# Altium schematic sheet Expansion.SchDoc: SION Expansion Board
size A4; Organization: UNSW Solar Racing Team; Address3: UNSW; Address4: Sydney NSW 2052; Address2: Electrical Engineering; Address1: Room 342
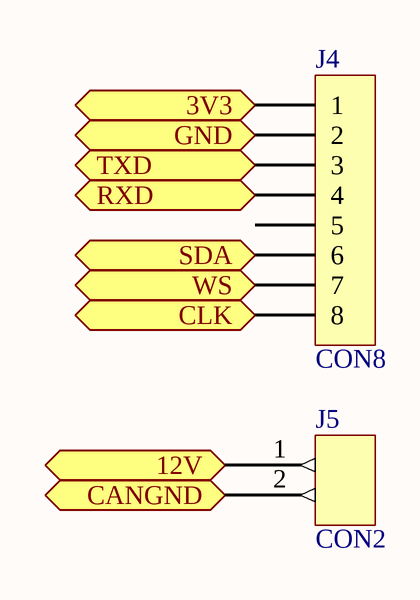
[diagram p0: Expansion.SchDoc]

## Parts
J4  CON8  [IDC8]
J5  CON2  [HDR1X2C]

## Ports
3V3 (in), 12V (out), CANGND (out), CLK (in), GND (in), RXD (in), SDA (in), TXD (out), WS (out)

## Nets
3V3: J4.1 ; port 3V3
12V: J5.1 ; port 12V
CANGND: J5.2 ; port CANGND
CLK: J4.8 ; port CLK
GND: J4.2 ; port GND
RXD: J4.4 ; port RXD
SDA: J4.6 ; port SDA
TXD: J4.3 ; port TXD
WS: J4.7 ; port WS

Not connected (* = marked no-connect by the designer): J4 5

## Notes on the sheet
- Title
- Size:
- Date:
- A4
- Number:
- Time:
- Revision:
- Sheet
- of
- File:

## Library data of the parts
J4 = CON8: 8 Pin 3.5mm Screw Terminal  header; Farnell: 617-507; Farnell - Opposite: 617-404 or 155-408